# Altium schematic sheet Power_Circuit.SchDoc
size A; SheetNumber: 3; SheetTotal: 6
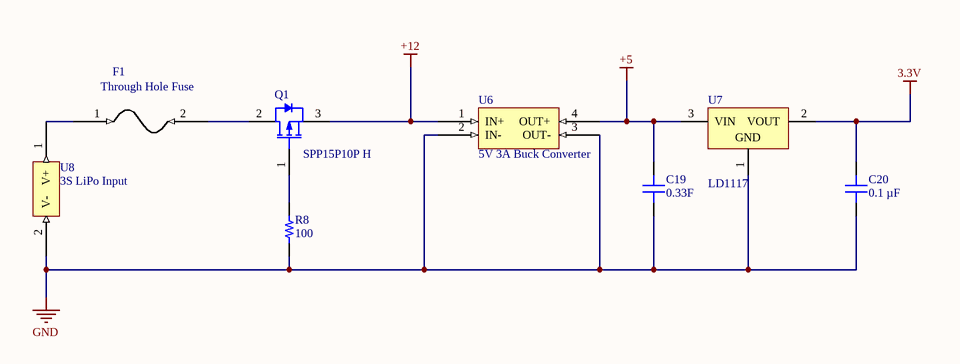
[diagram p0: Power_Circuit.SchDoc]

## Parts
C19  0.33F  [CAP 1206_3216 - 0.8MM]
C20  0.1 µF  [CAP 1206_3216 - 0.8MM]
F1  Through Hole Fuse  [Through Hole Fuse-Footprint-1]
Q1  SPP15P10P H  [INF-PG-TO220-3-1_A_V]
R8  100  [RES 1206_3216]
U6  5V 3A Buck Converter  [5V 3A Buck Converter-Footprint-1]
U7  LD1117  [PCB - LEADED - TO - TO-220]
U8  3S LiPo Input  [3S LiPo Input-Footprint-2]

## Nets
3.3V: C20.2 U7.2(VOUT)
+5: C19.2 U6.4(OUT+) U7.3(VIN)
+12: Q1.3(SOURCE) U6.1(IN+)
GND: C19.1 C20.1 R8.1 U6.2(IN-) U6.3(OUT-) U7.1(GND) U8.2(V-)
NetF1_1: F1.1 U8.1(V+)
NetF1_2: F1.2 Q1.2(DRAIN)
NetQ1_1: Q1.1(GATE) R8.2

## Library data of the parts
C19 = CC1206ZRY5V9BB104: CAP CER 0.1UF 50V Y5V 1206; manufacturer: Yageo; Capacitance: 0.1 µF; Temperature Coefficient: Y5V (F); Tolerance: -20%, +80%; Part Number: CC1206ZRY5V9BB104; Value: 0.33F; Applications: General Purpose; componentlink1description: Datasheet; componentlink1url: http://www.yageo.com/NewPortal/_en/search/productDocs.jsp?YageoPartNumber=CC1206ZRY5V9BB104; componentlink2description: DigiKey Link; componentlink2url: https://www.digikey.com/en/products/detail/yageo/CC1206ZRY5V9BB104/5884687; Device Package: 1206 (3216 Metric); lastupdated: 9/19/2022 1:06:25 PM; Lifecycle Status: Active; Minimum Order: 1; Mounting Type: Surface Mount, MLCC; Operating Temperature: -30°C ~ 85°C; Package / Case: 1206 (3216 Metric); packaging: TapeAndReel; partid: 18813; Part Status: Active; price: 0.04; series: CC; Size / Dimension: 0.126" L x 0.063" W (3.20mm x 1.60mm); Supplier 1: DigiKey; Supplier Part Number 1: 311-4505-1-ND; Thickness (Max): 0.028" (0.70mm); Voltage - Rated: 50V
C20 = CC1206ZRY5V9BB104: CAP CER 0.1UF 50V Y5V 1206; manufacturer: Yageo; Temperature Coefficient: Y5V (F); Tolerance: -20%, +80%; Part Number: CC1206ZRY5V9BB104; Value: 0.1 µF; Applications: General Purpose; Capacitance: 0.1 µF; componentlink1description: Datasheet; componentlink1url: http://www.yageo.com/NewPortal/_en/search/productDocs.jsp?YageoPartNumber=CC1206ZRY5V9BB104; componentlink2description: DigiKey Link; componentlink2url: https://www.digikey.com/en/products/detail/yageo/CC1206ZRY5V9BB104/5884687; Device Package: 1206 (3216 Metric); lastupdated: 9/19/2022 1:06:25 PM; Lifecycle Status: Active; Minimum Order: 1; Mounting Type: Surface Mount, MLCC; Operating Temperature: -30°C ~ 85°C; Package / Case: 1206 (3216 Metric); packaging: TapeAndReel; partid: 18813; Part Status: Active; price: 0.04; series: CC; Size / Dimension: 0.126" L x 0.063" W (3.20mm x 1.60mm); Supplier 1: DigiKey; Supplier Part Number 1: 311-4505-1-ND; Thickness (Max): 0.028" (0.70mm); Voltage - Rated: 50V
F1 = CMP-00003-2: Fuse that be through the hole
Q1 = CMP-1099-00049-1: P-Channel SIPMOS Small-Signal-Transistor, -100 V VDS, -15 A ID, -55 to 175 degC, PG-TO220-3-1, Tube, Green; Manufacturer: Infineon; RDS (on) (max): 240Â mOhm; Green: TRUE; VGS(th) (min): -4Â V; RthJC (max): 1.17Â K/W; IDpuls (max): -60Â A; VGS(th) (max): -2.1Â V; Pto t (max): 128Â W; VDS (max): -100Â V; ID (max): -15Â A; QG: 37Â nC; ComponentLink1Description: Manufacturer URL; ComponentLink3URL: http://www.infineon.com/dgdl/IPP028N08N3_Rev1%5B1%5D.0.pdf?folderId=db3a304313b8b5a60113cee8763b02d7&fileId=db3a30432313ff5e0123a3c08e7326b5; ComponentLink2Description: Datasheet; Halogen-free: TRUE; ComponentLink3Description: Package Specification; PackageDescription: 3-Pin Plastic (Green) Transistor Single Outline Package, 10.03 x 8.98 mm Body, 2.54 mm Pitch; ComponentLink1URL: http://www.infineon.com/; Mounting Technology: Through Hole; Rth: 1.17Â K/W; DatasheetVersion: Rev. 1.7; PartNumber: SPP15P10P H; Packing: Tube; ComponentLink2URL: http://www.infineon.com/dgdl/SPP15P10P+H+G_Rev1.7.pdf?folderId=db3a304314dca38901154a72e3951a65&fileId=db3a3043321e49940132246d96be5a7e; PackageReference: PG-TO220-3-1; PackageVersion: Rev. 05, 08/2007
R8 = ESR18EZPF1002: RES SMD 10K OHM 1% 1/2W 1206; Manufacturer: Rohm Semiconductor; Power (Watts): 0.5W, 1/2W; Resistance: 10 kOhms; Temperature Coefficient: ±100ppm/°C; Value: 10 kOhms; Part Number: ESR18EZPF1002; ComponentLink1Description: Datasheet; ComponentLink1URL: https://www.rohm.com/datasheet/ESR01MZPF/esr-e; ComponentLink2Description: DigiKey Link; ComponentLink2URL: https://www.digikey.com/en/products/detail/rohm-semiconductor/ESR18EZPF1002/1983592; Composition: Thick Film; Device Package: 1206 (3216 Metric); Features: Automotive AEC-Q200, Pulse Withstanding; Height - Seated (Max): 0.026" (0.65mm); LastUpdated: 9/19/2022 1:29:57 PM; Lifecycle Status: Active; Minimum Order: 1; Number of Terminations: 2; Operating Temperature: -55°C ~ 155°C; Package / Case: 1206 (3216 Metric); Packaging: TapeAndReel; PartId: 26965; Part Status: Active; Price: 0.02; Ratings: AEC-Q200; Series: ESR; Size / Dimension: 0.126" L x 0.063" W (3.20mm x 1.60mm); Supplier 1: DigiKey; Supplier Part Number 1: RHM10.0KAFCT-ND; Supplier Device Package: 1206; Tolerance: ±1%
U6 = CMP-00002-2: Adafruit RC Buck converter
U7 = 776: Linear Voltage Regulator IC  1 Output  1A TO-220AB; Rowan Part Number: 776; Manufacturer: STMicroelectronics; Manufacturer part number: LD1117AV33; Name: LD1117 - 3.3V Linear Regulator; Voltage - Output (Min or Fixed): 3.3V; Output Type: Fixed; Voltage - Input (Max): 15V; Dropout Voltage: 1.3V @ 1A; Output Configuration: Positive; Supplier 1: Digi-Key; Supplier Part Number 1: 497-1485-5-ND; Category: Linear Regulators; Datasheet: http://www.st.com/content/ccc/resource/technical/document/datasheet/a5/c3/3f/c9/2b/15/40/49/CD00002116.pdf/files/CD00002116.pdf/jcr:content/translations/en.CD00002116.pdf; Status: Active; Output Current: 1A; Voltage - Output (Max): -; Package: TO-220-3; Packaging: Tube; Type: Linear Regulator; Base Part Number: LD1117
U8 = CMP-00000-1